# Altium schematic sheet Power.SchDoc
size A4; SheetNumber: 2; SheetTotal: 4
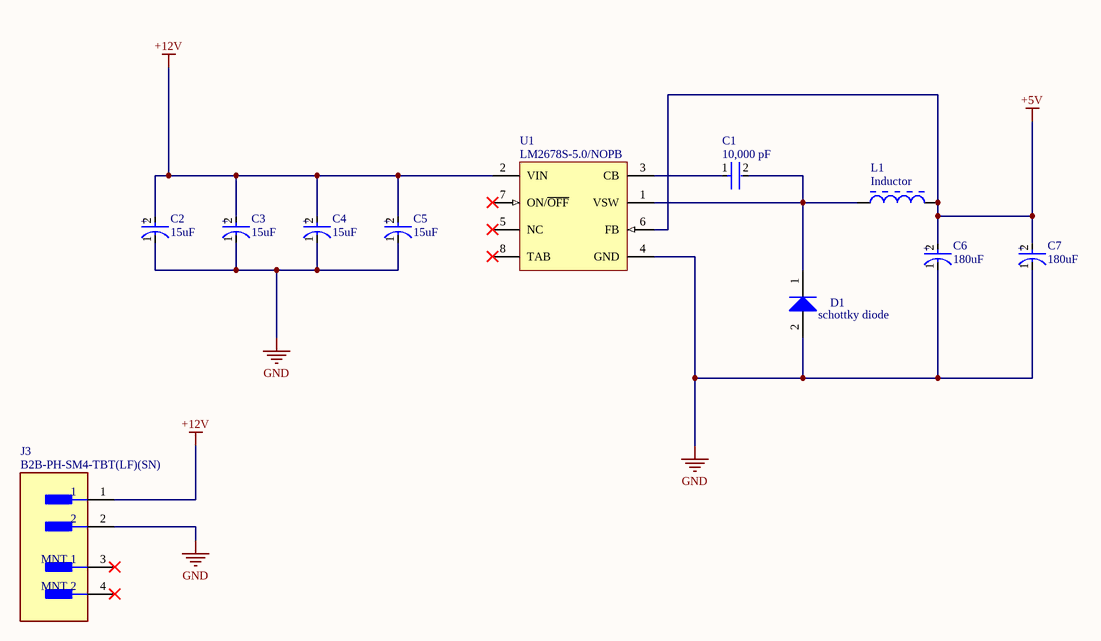
[diagram p0: Power.SchDoc]

## Parts
C1  value 10,000 pF  [FP-C0805C-DN-MFG]  (hidden comment: C0805C103K1RACTU)
C2  Capacitance: 15uF  [FP-TAJS-MFG]  (hidden comment: TAJS156K006RNJ)
C3  Capacitance: 15uF  [FP-TAJS-MFG]  (hidden comment: TAJS156K006RNJ)
C4  Capacitance: 15uF  [FP-TAJS-MFG]  (hidden comment: TAJS156K006RNJ)
C5  Capacitance: 15uF  [FP-TAJS-MFG]  (hidden comment: TAJS156K006RNJ)
C6  Capacitance: 180uF  [FP-SP-Cap-X-MFG]  (hidden comment: EEFSX0D181ER)
C7  Capacitance: 180uF  [FP-SP-Cap-X-MFG]  (hidden comment: EEFSX0D181ER)
D1  Model: schottky diode  [INF-SOD323_V]  (hidden comment: BAS3010B-03W)
J3  B2B-PH-SM4-TBT(LF)(SN)  [FP-B2B-PH-SM4-TBT_LF_SN-MFG]
L1  Model: Inductor  [BOUR-SRN3015-2_V]  (hidden comment: SRN3015-220M)
U1  LM2678S-5.0/NOPB  [KTW0007B_L]

## Nets
+5V: C6.2(A) C7.2(A) L1.2 U1.6(FB)
+12V: C2.2(A) C3.2(A) C4.2(A) C5.2(A) J3.1 U1.2(VIN)
GND: C2.1(C) C3.1(C) C4.1(C) C5.1(C) C6.1(C) C7.1(C) D1.2(A) J3.2 U1.4(GND)
NetC1_1: C1.1 U1.3(CB)
NetC1_2: C1.2 D1.1(K) L1.1 U1.1(VSW)

Not connected (* = marked no-connect by the designer): J3 3(MNT_1)* 4(MNT_2)*; U1 5(NC)* 7(ON/~{OFF})* 8(TAB)*

## Notes on the sheet
- (in symbol CMP-04424-000383-1) +
- (in symbol CMP-05428-000369-1) +

## Library data of the parts
C1 = CMP-03020-018902-1: CAP CER 10000PF 100V X7R 0805; Manufacturer: KEMET; Material: Ceramic; Temperature Coefficient: 30ppm/°C; Tolerance: 0.1; Octopart: https://octopart.com/c0805c103k1ractu-kemet-97824; Capacitance: 10,000 pF; Ipc Land Pattern Name: CAPC200125X78; Temperature: -55°C to +125°C; Temperature Range High: +125°C; Temperature Range Low: -55°C; Category: Cap; Voltage Rating: 100 V; ComponentLink2Description: Datasheet; Device Class L3: Ceramic Capacitors; ComponentLink2URL: https://content.kemet.com/datasheets/KEM_C1003_C0G_SMD.pdf; Automotive: No; Temperature Characteristic: X7R; Digikey Description: CAP CER 10000PF 100V X7R 0805; Package: C0805C-DN; Height: 0.88mm; Device Class L2: Capacitors; Mouser Description: Cap Ceramic 0.01uF 100V X7R 10% SMD 0805 125°C Paper T/R; Device Class L1: Passive Components; Lead Free: Yes; RoHS: TRUE; Manufacturer Part Number: C0805C103K1RACTU
C2-C5 = CMP-04424-000383-1: 15uF 6.3V  ±10% 3.5Ω 1206  SMD Tantalum Capacitor; Dissipation Factor: 8%; Leakage Current: 900nA; Polarity: Polar; ESR (Equivalent Series Resistance): 4R; Voltage Rating (DC): 6.3V; Weight: 0.000571oz; Max Operating Temperature: 125°C; Voltage Rating: 6.3V; Number of Pins: 2; Construction: Flat; Termination: SMD/SMT; Depth: 1.6mm; Width: 0.063inch; Series: TAJ; Packaging: Tape and Reel; Package Quantity: 1; Case Code (Imperial): 1206; Tolerance: 10%; Radiation Hardening: No; Features: General Purpose; Min Operating Temperature: -55°C; Height - Seated (Max): 0.047inch; RoHS Compliant: Yes; Length: 3.2mm; Case Code (Metric): 3216; Case/Package: 1206; Dielectric Material: Tantalum; Height: 1.2mm; Lead Free: Lead Free; Mount: Surface Mount; Voltage: 6.3V; Resistance: 4R
C6 C7 = CMP-05428-000369-1: Molded Aluminum Polymer Capacitor 180uF 20% 2V life 2000Hours SMD 2917; ESR (Equivalent Series Resistance): 9mR; Life (Hours): 1000Hour; Ripple Current: 3A; Dielectric Material: Aluminium; Dissipation Factor: 0.06%; Leakage Current: 36uA; Max Operating Temperature: 105°C; Packaging: Tape and Reel; Case Code (Metric): 7343; Package Quantity: 3500; Voltage Rating (DC): 2V; Mount: Surface Mount; RoHS Compliant: Yes; Termination: SMD/SMT; Depth: 4.3mm; Voltage: 2V; Series: SP-Cap SX; Ripple Current (AC): 3A; Height - Seated (Max): 0.083inch; Voltage Rating: 2V; Length: 7.3mm; Construction: Flat; Case Code (Imperial): 2917; Min Operating Temperature: -40°C; Height: 1.9mm; Number of Pins: 2; Case/Package: 2917; Width: 4.3mm; Tolerance: 20%
D1 = CMP-1183-00005-1: Medium Power AF Schottky Diode, -65 to 125 degC, SOD323, Reel, Green; Manufacturer: Infineon; CT (max): 40Â pF; Configuration: Single; VR (max): 30Â V; Green: TRUE; IF (max): 1,000Â mA; VF (max): 550Â mV; PackageReference: SOD323; ComponentLink1URL: http://www.infineon.com/; ComponentLink1Description: Manufacturer URL; Mounting Technology: Surface Mount; Packing: Reel; ComponentLink3Description: Package Specification; PackageDescription: 2-Pin Small Outline Diode Package, 1.25 x 1.7 mm Body; ComponentLink2Description: Datasheet; ComponentLink3URL: http://www.infineon.com/dgdl/SOD323-Package_Overview.pdf?folderId=db3a30431936bc4b011952aab84f3bbe&fileId=db3a30431936bc4b011952beed653be3; ComponentLink2URL: http://www.infineon.com/dgdl/bas3010bseries.pdf?folderId=db3a304313d846880113def5812204a1&fileId=db3a304313e278750113e29a03a70005; PartNumber: BAS3010B-03W
J3 = CMP-17439-000005-1: CONN HEADER SMD 2POS 2MM; Manufacturer: JST; Current Rating: 2A; Conn Gender: Male; Voltage Rating: 100V; Conn Orientation: Vertical; Number Of Contacts: 2; Octopart: https://octopart.com/b2b-ph-sm4-tbt%28lf%29%28sn%29-jst-7877930; Number Of Rows: 1; Device Class L2: Headers and Wire Housings; RoHS: TRUE; Contact Material: Tin,Copper; Height: 6.65mm; Temperature: -25°C to +85°C; Temperature Range Low: -25°C; ComponentLink2Description: Datasheet; Manufacturer Part Number: B2B-PH-SM4-TBT(LF)(SN); ComponentLink2URL: http://www.jst-mfg.com/product/pdf/eng/ePH.pdf; Automotive: No; Pitch: 2mm; Lead Free: Yes; Device Class L3: unset; Category: Conn; Digikey Description: CONN HEADER SMD 2POS 2MM; Temperature Range High: +85°C; Package: 0; Device Class L1: Connectors
L1 = CMP-0007-00013-1: Semi-shielded Power Inductor, 22 uH, +/- 20%, 0.6 A, -40 to 125 degC, 3 x 3 x 1.5 mm SMD, RoHS and Halogen Free, Tape and Reel; Manufacturer: Bourns; SRF Min: 28 MHz; Isat: 0.58 A; Resistance to Solder Heat: +260 degC for 10 sec.; Inductance tolerance: +/- 20%; Inductance: 22 uH; Rated current: 0.6 A; DCR Max: 0.622 Ohm; RoHS: TRUE; ComponentLink1Description: Manufacturer URL; ComponentLink3URL: http://www.bourns.com/data/global/pdfs/SRN3015.pdf; PartNumber: SRN3015-220M; DatasheetVersion: Aug-11; Mounting Technology: Surface Mount; ComponentLink3Description: Package Specification; ComponentLink2Description: Datasheet; Operating Temperature: -40 to 125 degC; PackageDescription: 2-Pin SMD, Body 3 x 3 mm, Height 1.5 mm; Packing: Tape and Reel; PackageReference: SRN3015; ComponentLink2URL: http://www.bourns.com/data/global/pdfs/SRN3015.pdf; ComponentLink1URL: http://www.bourns.com/
U1 = CMP-0069-00189-3: SIMPLE SWITCHER® High Efficiency 5A Step-Down Voltage Regulator, 7-pin TO-263, Pb-Free; Manufacturer: Texas Instruments; PackageTopMarking: NSUZXYTTE#*LM2678*S-5.0; PowerWise: N; PackageReference: KTW0007B; RoHS: Y; ComponentLink1URL: http://www.ti.com/general/docs/lit/getliterature.tsp?genericPartNumber=LM2678&fileType=pdf; ComponentLink1Description: Datasheet URL; PackageDescription: TO-263, Molded, .400 x .390 x .180in Body, 7 Lead, .050in Pitch, Surface Mount; Code_JEDEC: MO-169-AC; PinCount: 7; CompType: Switcher